# Altium schematic sheet Board.SchDoc
size 584 x 381 mm
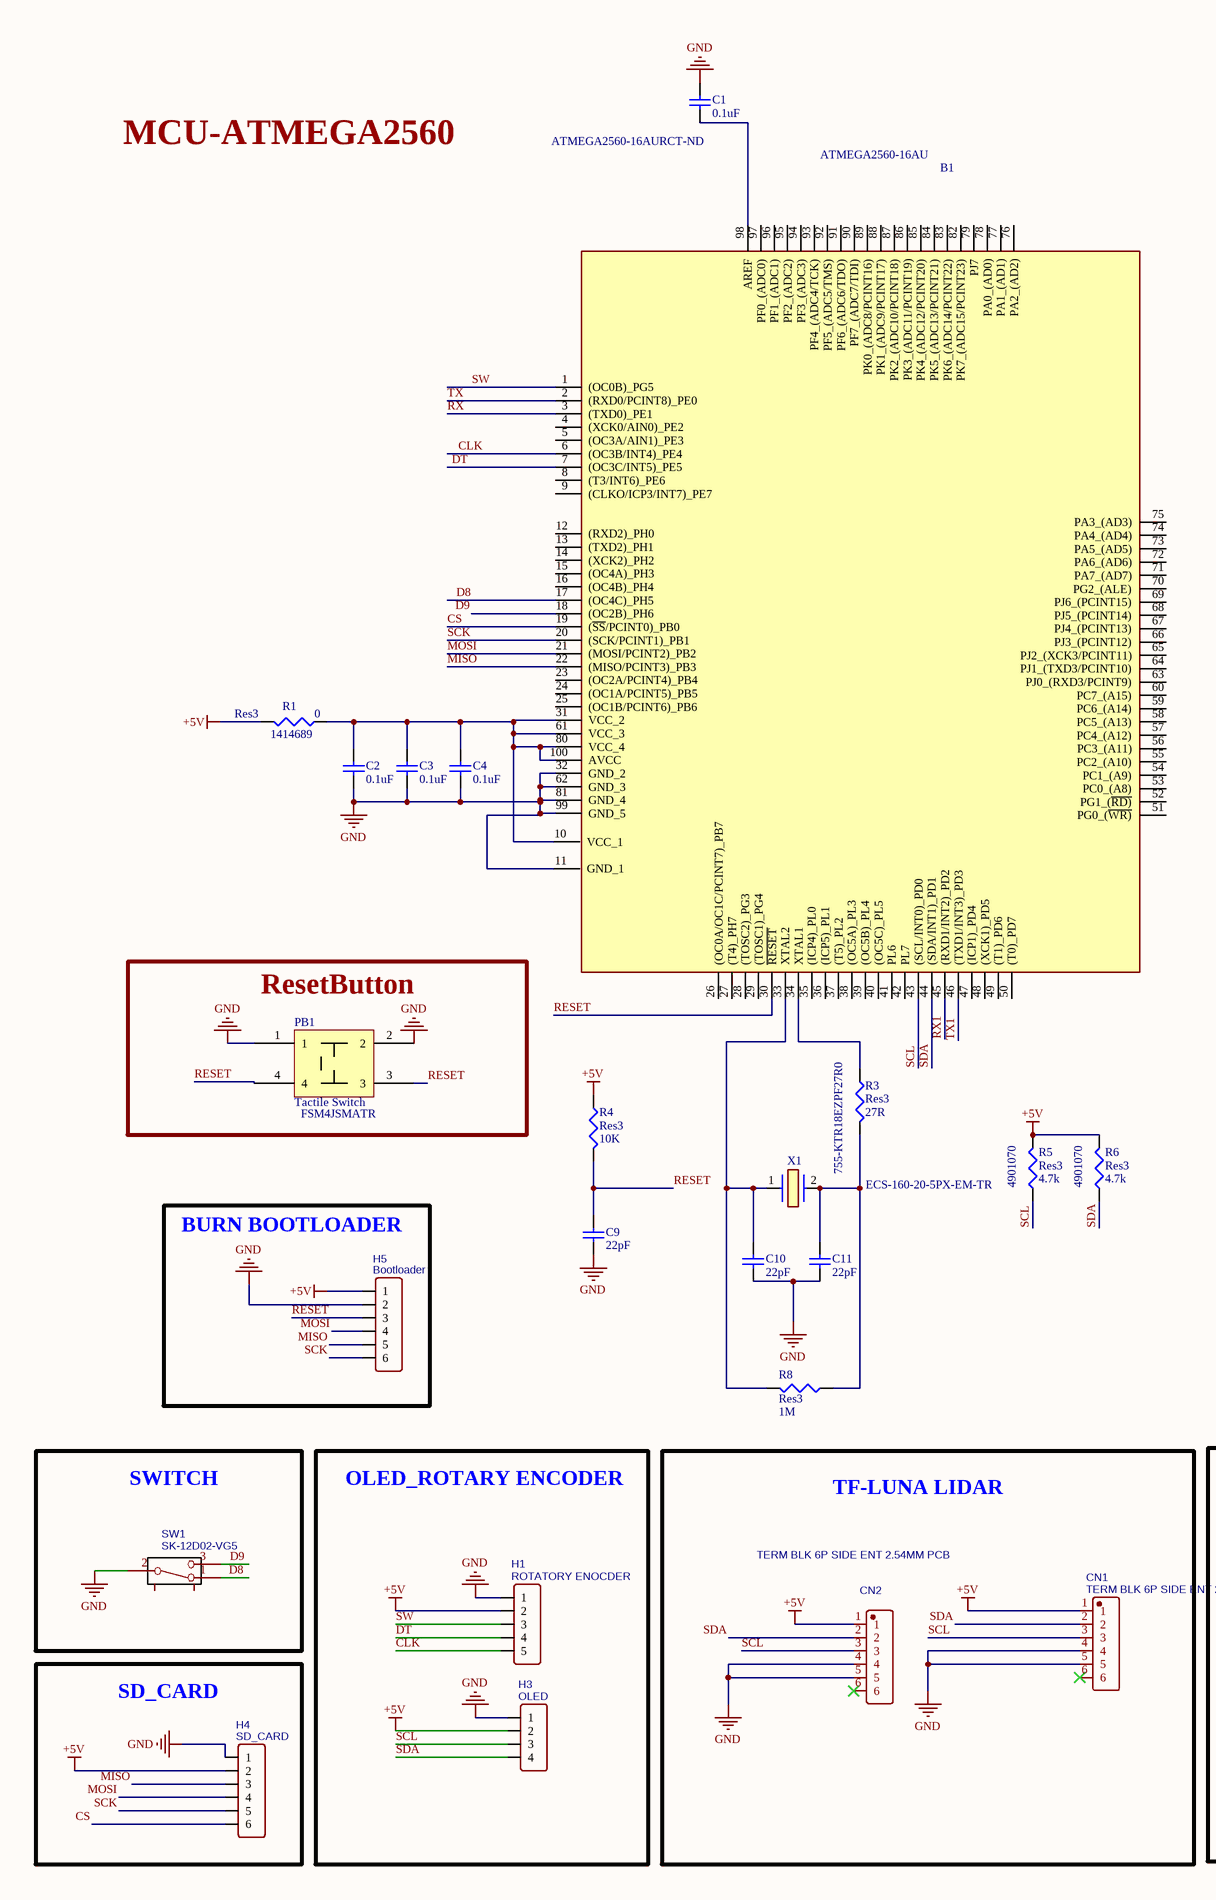
[diagram p0: Board.SchDoc, left]
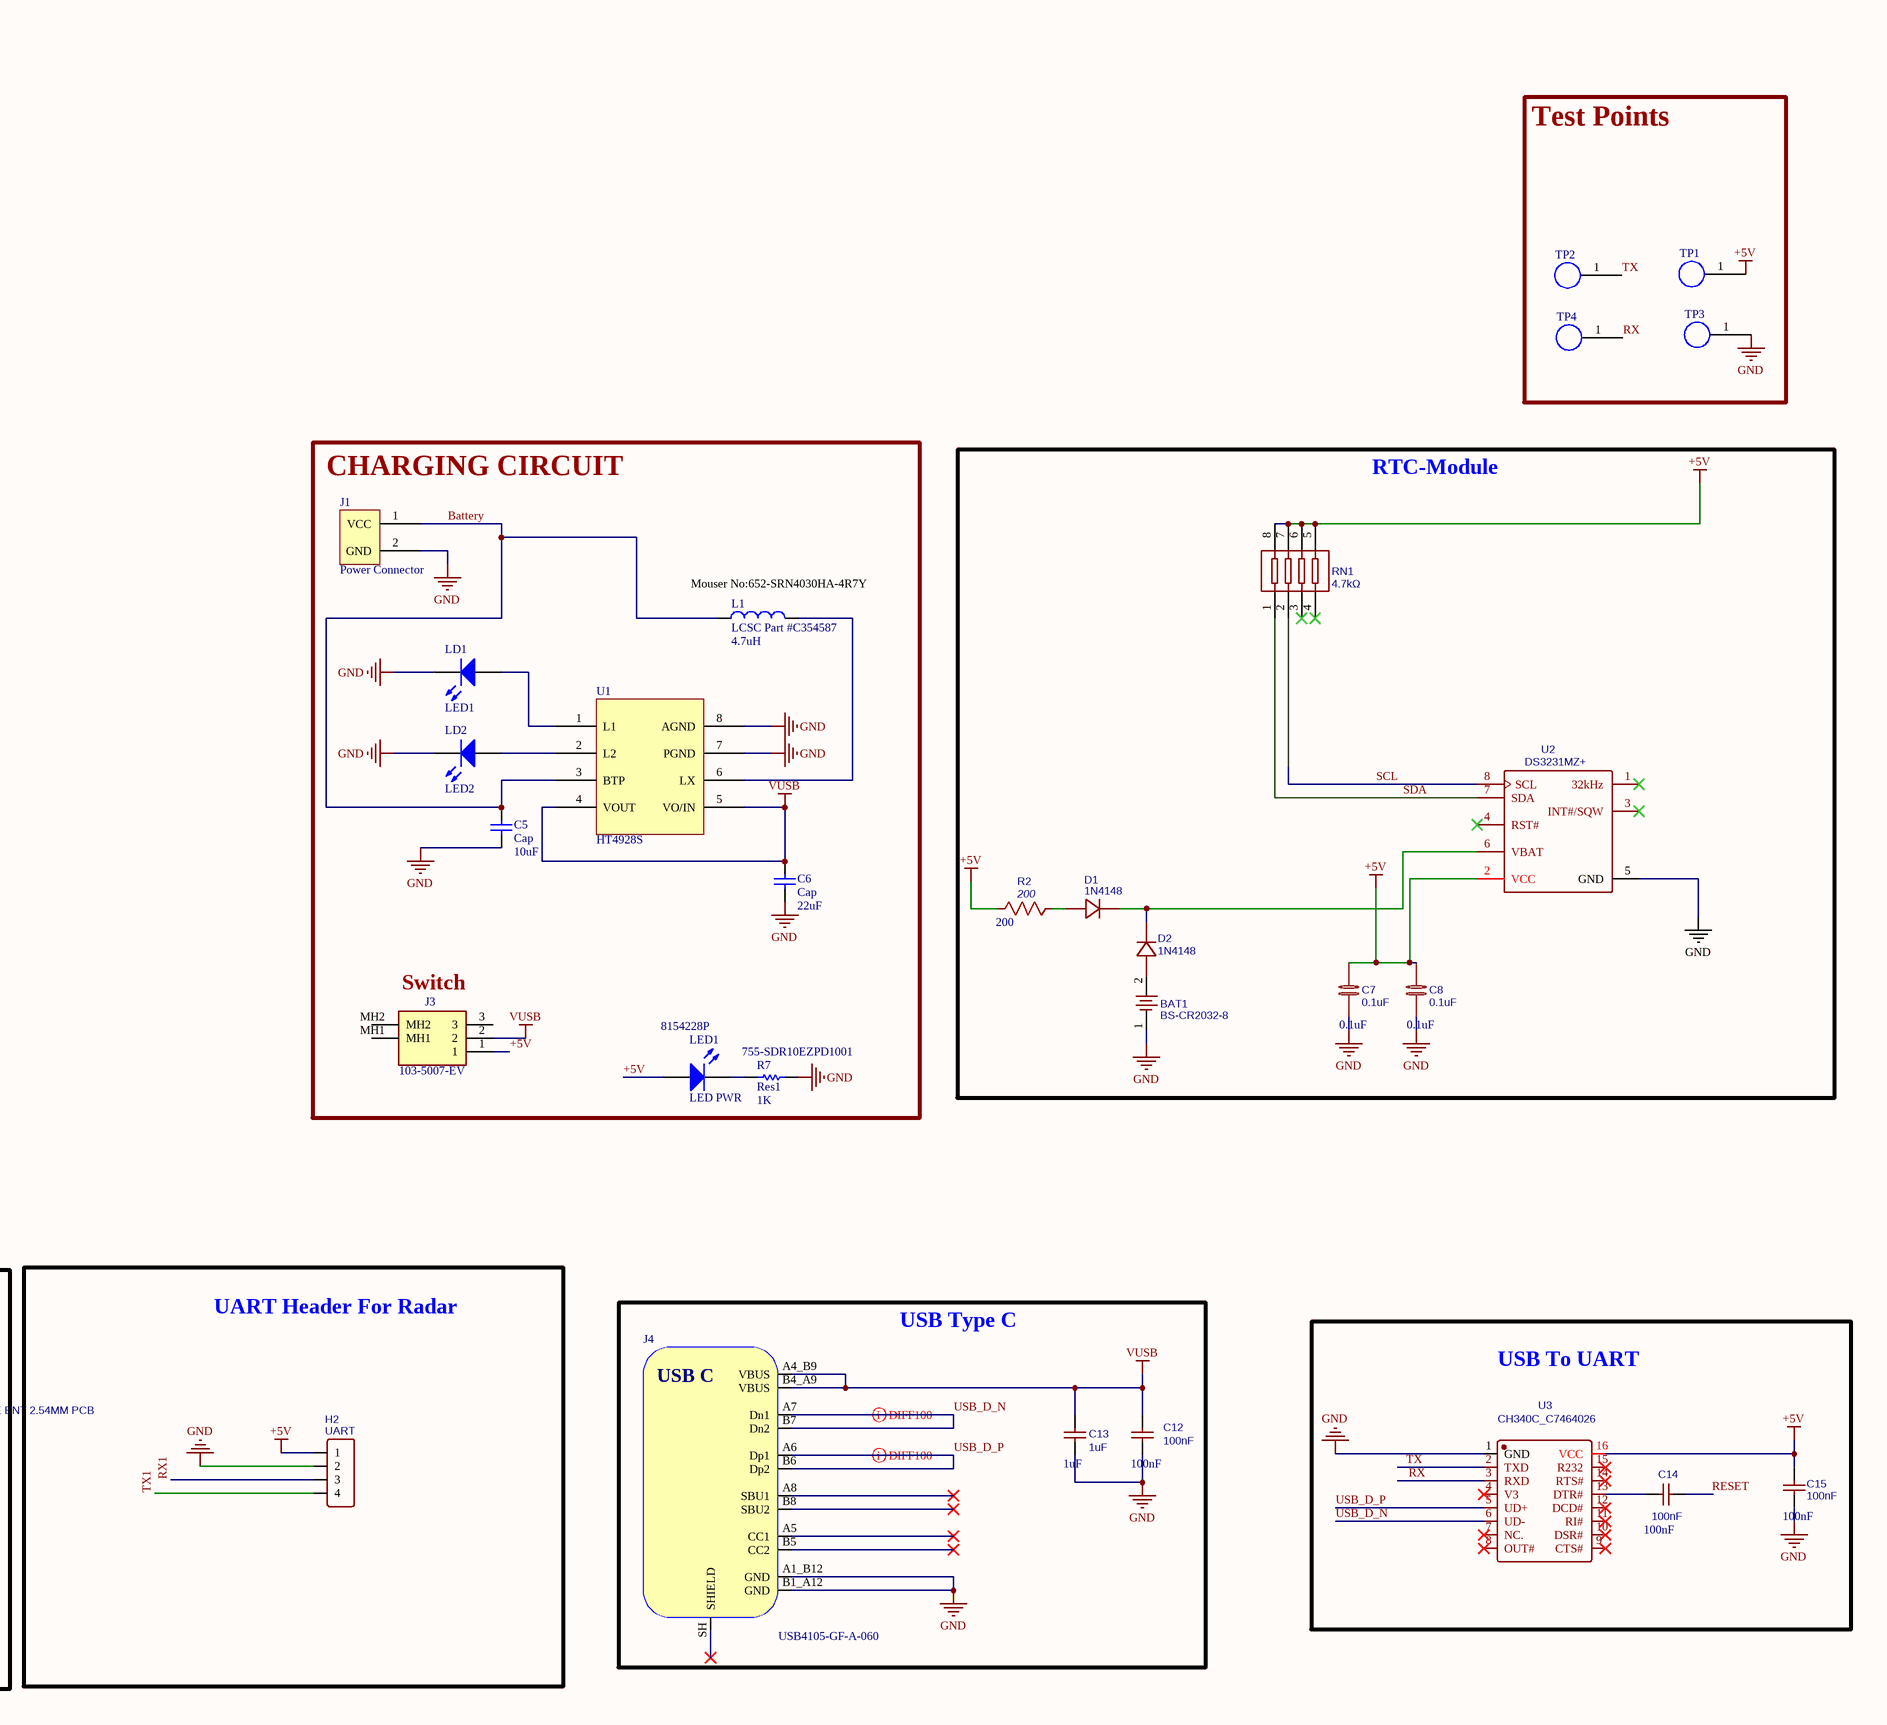
[diagram p1: Board.SchDoc, right]

## Parts
B1  ATMEGA2560-16AU  Supplier Part Number 1: ATMEGA2560-16AURCT-ND  [ATMEGA2560-16AUR]
BAT1  BS-CR2032-8  [BS-CR2032-8]
C1  value 0.1uF  [CAP 0402]  (hidden comment: Cap)
C2  value 0.1uF  [CAP 0402]  (hidden comment: Cap)
C3  value 0.1uF  [CAP 0402]  (hidden comment: Cap)
C4  value 0.1uF  [CAP 0402]  (hidden comment: Cap)
C5  Cap  value 10uF  [Cap_0603]
C6  Cap  value 22uF  [CAP 1206]
C7  0.1uF  [CAP_0805]
C8  0.1uF  [CAP_0805]
C9  value 22pF  [CAP 1206]  (hidden comment: Cap)
C10  value 22pF  [CAP 1206]  (hidden comment: Cap)
C11  value 22pF  [CAP 1206]  (hidden comment: Cap)
C12  100nF  [Cap_0603]
C13  1uF  [Cap_0603]
C14  100nF  [Cap_0603]
C15  100nF  [Cap_0603]
CN1  TERM BLK 6P SIDE ENT 2.54MM PCB  [1725698]
CN2  TERM BLK 6P SIDE ENT 2.54MM PCB  [1725698]
D1  1N4148  [1N4148WS]
D2  1N4148  [1N4148WS]
H1  ROTATORY ENOCDER  [HDR 1X5]
H2  UART  [H2]
H3  OLED  [HDR 1X4]
H4  SD_CARD  [HDR 1X6]
H5  Bootloader  [HDR 1X6]
J1  Power Connector  [1725656]
J3  103-5007-EV  [1035007EV]
J4  USB4105-GF-A-060  [USB4105GFA060]
L1  LCSC Part #C354587  value 4.7uH  [L1]
LD1  LED1  [0603-LED]
LD2  LED2  [0603-LED]
LED1  LED PWR  Supplier Part Number 1: 8154228P  [0603-LED]
PB1  Tactile Switch  Supplier Part Number 1: FSM4JSMATR  [PB1]
R1  Res3  value 0  Supplier Part Number 1: 1414689  [1206-res]
R2  200  [Res_0805]
R3  Res3  value 27R  Supplier Part Number 1: 755-KTR18EZPF27R0  [1206-res]
R4  Res3  value 10K  [1206-res]
R5  Res3  value 4.7k  Supplier Part Number 1: 4901070  [1206-res]
R6  Res3  value 4.7k  Supplier Part Number 1: 4901070  [1206-res]
R7  Res1  value 1K  Supplier Part Number 1: 755-SDR10EZPD1001  [Res_0805]
R8  Res3  value 1M  [1206-res]
RN1  4.7kΩ  [WA04X472JTL]
SW1  SK-12D02-VG5  [SK12D02GA42S]
TP1  (no value)  [TP]
TP2  (no value)  [TP]
TP3  (no value)  [TP]
TP4  (no value)  [TP]
U1  HT4928S  [DS3231MZ+TRL]
U2  DS3231MZ+  [DS3231MZ+TRL]
U3  CH340C_C7464026  [CH340C]
X1  ECS-160-20-5PX-EM-TR  [X1]

## Blocks framed on the sheet
Test Points: TP1-TP4
CHARGING CIRCUIT: C5 C6 J1 J3 L1 LD1 LD2 LED1 R7 U1
RTC-Module: BAT1 C7 C8 D1 D2 R2 RN1 U2
ResetButton: PB1
BURN BOOTLOADER: H5
SWITCH: SW1
OLED_ROTARY ENCODER: H1 H3
TF-LUNA LIDAR: CN1 CN2
UART Header For Radar: H2
USB Type C: C12 C13 J4
USB To UART: C14 C15 U3
SD_CARD: H4

## Nets
+5V: C7.2 C8.2 C15.1 CN1.1 CN2.1 H1.2 H2.1 H3.2 H4.2 H5.1 J3.1 LED1.1(A) R1.2 R2.1 R4.1 R5.2 R6.2 RN1.5 RN1.6 RN1.7 RN1.8 TP1.1(TP) U2.2(VCC) U3.16(VCC)
GND: B1.11(GND_1) B1.32(GND_2) B1.62(GND_3) B1.81(GND_4) B1.99(GND_5) BAT1.1 C1.1 C2.2 C3.2 C4.2 C5.2 C6.2 C7.1 C8.1 C9.2 C10.2 C11.2 C12.1 C13.1 C15.2 CN1.4 CN1.5 CN2.4 CN2.5 H1.1 H2.2 H3.1 H4.1 H5.2 J1.2(GND) J4.A1_B12(GND) J4.B1_A12(GND) LD1.2(K) LD2.2(K) PB1.1 PB1.2 R7.1 SW1.2 TP3.1(TP) U1.7(PGND) U1.8(AGND) U2.5(GND) U3.1(GND)
VUSB: C6.1 C12.2 C13.2 J3.2 J4.A4_B9(VBUS) J4.B4_A9(VBUS) U1.4(VOUT) U1.5(VO/IN)
Battery: C5.1 J1.1(VCC) L1.1 U1.3(BTP)
CLK: B1.6((OC3B/INT4)_PE4) H1.5
CS: B1.19((~{SS}/PCINT0)_PB0) H4.6
D8: B1.17((OC4C)_PH5) SW1.1
D9: B1.18((OC2B)_PH6) SW1.3
DT: B1.7((OC3C/INT5)_PE5) H1.4
MISO: B1.22((MISO/PCINT3)_PB3) H4.3 H5.5
MOSI: B1.21((MOSI/PCINT2)_PB2) H4.4 H5.4
RESET: B1.30(~{RESET}) C9.1 C14.2 H5.3 PB1.3 PB1.4 R4.2
RX: B1.3((TXD0)_PE1) TP4.1(TP) U3.3(RXD)
RX1: B1.45((RXD1/INT2)_PD2) H2.3
SCK: B1.20((SCK/PCINT1)_PB1) H4.5 H5.6
SCL: B1.43((SCL/INT0)_PD0) CN1.3 CN2.3 H3.3 R5.1 RN1.2 U2.8(SCL)
SDA: B1.44((SDA/INT1)_PD1) CN1.2 CN2.2 H3.4 R6.1 RN1.1 U2.7(SDA)
SW: B1.1((OC0B)_PG5) H1.3
TX: B1.2((RXD0/PCINT8)_PE0) TP2.1(TP) U3.2(TXD)
TX1: B1.46((TXD1/INT3)_PD3) H2.4
USB_D_N: J4.A7(Dn1) J4.B7(Dn2) U3.6(UD-)
USB_D_P: J4.A6(Dp1) J4.B6(Dp2) U3.5(UD+)
NetB1_10: B1.10(VCC_1) B1.31(VCC_2) B1.61(VCC_3) B1.80(VCC_4) B1.100(AVCC) C2.1 C3.1 C4.1 R1.1
NetB1_33: B1.33(XTAL2) C10.1 R8.2 X1.1
NetB1_34: B1.34(XTAL1) R3.1
NetB1_98: B1.98(AREF) C1.2
NetBAT1_2: BAT1.2 D2.1(A)
NetC11_1: C11.1 R3.2 R8.1 X1.2(CRYSTAL__2)
NetC14_1: C14.1 U3.13(DTR#)
NetD1_1: D1.1(A) R2.2
NetD1_2: D1.2(C) D2.2(C) U2.6(VBAT)
NetL1_2: L1.2 U1.6(LX)
NetLD1_1: LD1.1(A) U1.1(L1)
NetLD2_1: LD2.1(A) U1.2(L2)
NetLED1_2: LED1.2(K) R7.2

Not connected (* = marked no-connect by the designer): B1 4((XCK0/AIN0)_PE2) 5((OC3A/AIN1)_PE3) 8((T3/INT6)_PE6) 9((CLKO/ICP3/INT7)_PE7) 12((RXD2)_PH0) 13((TXD2)_PH1) 14((XCK2)_PH2) 15((OC4A)_PH3) 16((OC4B)_PH4) 23((OC2A/PCINT4)_PB4) 24((OC1A/PCINT5)_PB5) 25((OC1B/PCINT6)_PB6) 26((OC0A/OC1C/PCINT7)_PB7) 27((T4)_PH7) 28((TOSC2)_PG3) 29((TOSC1)_PG4) 35((ICP4)_PL0) 36((ICP5)_PL1) 37((T5)_PL2) 38((OC5A)_PL3) 39((OC5B)_PL4) 40((OC5C)_PL5) 41(PL6) 42(PL7) 47((ICP1)_PD4) 48((XCK1)_PD5) 49((T1)_PD6) 50((T0)_PD7) 51(PG0_(~{WR)}) 52(PG1_(~{RD)}) 53(PC0_(A8)) 54(PC1_(A9)) 55(PC2_(A10)) 56(PC3_(A11)) 57(PC4_(A12)) 58(PC5_(A13)) 59(PC6_(A14)) 60(PC7_(A15)) 63(PJ0_(RXD3/PCINT9)) 64(PJ1_(TXD3/PCINT10)) 65(PJ2_(XCK3/PCINT11)) 66(PJ3_(PCINT12)) 67(PJ4_(PCINT13)) 68(PJ5_(PCINT14)) 69(PJ6_(PCINT15)) 70(PG2_(ALE)) 71(PA7_(AD7)) 72(PA6_(AD6)) 73(PA5_(AD5)) 74(PA4_(AD4)) 75(PA3_(AD3)) 76(PA2_(AD2)) 77(PA1_(AD1)) 78(PA0_(AD0)) 79(PJ7) 82(PK7_(ADC15/PCINT23)) 83(PK6_(ADC14/PCINT22)) 84(PK5_(ADC13/PCINT21)) 85(PK4_(ADC12/PCINT20)) 86(PK3_(ADC11/PCINT19)) 87(PK2_(ADC10/PCINT18)) 88(PK1_(ADC9/PCINT17)) 89(PK0_(ADC8/PCINT16)) 90(PF7_(ADC7/TDI)) 91(PF6_(ADC6/TDO)) 92(PF5_(ADC5/TMS)) 93(PF4_(ADC4/TCK)) 94(PF3_(ADC3)) 95(PF2_(ADC2)) 96(PF1_(ADC1)) 97(PF0_(ADC0)); CN1 6*; CN2 6*; J3 3 MH1 MH2; J4 A5(CC1)* A8(SBU1)* B5(CC2)* B8(SBU2)* SH(SHIELD)*; RN1 3* 4*; SW1 4 5; U2 1(32kHz)* 3(INT#/SQW)* 4(RST#)*; U3 4(V3)* 7(NC.)* 8(OUT#)* 9(CTS#)* 10(DSR#)* 11(RI#)* 12(DCD#)* 14(RTS#)* 15(R232)*

## Layout directives
differential pair; differential pair class D100: USB_D_N, USB_D_P

## Notes on the sheet
- MCU-ATMEGA2560
- (near L1) Mouser No:652-SRN4030HA-4R7Y
- (near J3) Switch
- (in symbol USB4105-GF-A-060) USB C

## Library data of the parts
B1 = ATMEGA2560-16AU: AVR ATmega Microcontroller 8-bit 16MHz 256KB FLASH TQFP100; Manufacturer_Name: Microchip; Geometry.Height: 1.2mm; Mouser Part Number: 556-ATMEGA2560-16AU; Mouser Price/Stock: https://www.mouser.co.uk/ProductDetail/Microchip-Technology/ATMEGA2560-16AU?qs=aqrrBurbvGciYmlAokFS0w%3D%3D; Manufacturer_Part_Number: ATMEGA2560-16AU; Datasheet Link: https://datasheet.datasheetarchive.com/originals/distributors/Datasheets_SAMA/4a5a397fa76c39b5297f4121ace1d84e.pdf; Supplier 1: Digi-Key; Manufacturer: Microchip; Manufacturer Part Number: ATMEGA2560-16AUR; RoHS: Yes; Category: Microcontrollers; Stock 1: 1214; Pricing 1: 1=15.16 (USD); ComponentLink1URL: http://www.farnell.com/datasheets/1817551.pdf?src-supplier=Farnell; ComponentLink1Description: http://www.farnell.com/datasheets/1817551.pdf?src-supplier=Farnell; ComponentLink2URL: http://www.produktinfo.conrad.com/datenblaetter/1200000-1299999/001267435-da-01-en-IC_MCU_8BI_ATMEGA2560_16AUR_TQFP_100_ATM.pdf?src-supplier=Conrad; ComponentLink2Description: http://www.produktinfo.conrad.com/datenblaetter/1200000-1299999/001267435-da-01-en-IC_MCU_8BI_ATMEGA2560_16AUR_TQFP_100_ATM.pdf?src-supplier=Conrad; ComponentLink3URL: http://www.farnell.com/datasheets/1817551.pdf?src-supplier=Element14; ComponentLink3Description: http://www.farnell.com/datasheets/1817551.pdf?src-supplier=Element14; ComponentLink4URL: http://ww1.microchip.com/downloads/en/DeviceDoc/Atmel-2549-8-bit-AVR-Microcontroller-ATmega640-1280-1281-2560-2561_Summary.pdf?src-supplier=Digi-Key; ComponentLink4Description: http://ww1.microchip.com/downloads/en/DeviceDoc/Atmel-2549-8-bit-AVR-Microcontroller-ATmega640-1280-1281-2560-2561_Summary.pdf?src-supplier=Digi-Key; ComponentLink5URL: http://www.microchip.com/mymicrochip/filehandler.aspx?ddocname=en589901&src-supplier=Digi-Key; ComponentLink5Description: http://www.microchip.com/mymicrochip/filehandler.aspx?ddocname=en589901&src-supplier=Digi-Key; ComponentLink6URL: http://www.farnell.com/datasheets/1817551.pdf?src-supplier=Newark; ComponentLink6Description: http://www.farnell.com/datasheets/1817551.pdf?src-supplier=Newark; ComponentLink7URL: https://datasheet.octopart.com/ATMEGA2560-16AUR-Microchip-datasheet-46907977.pdf?src-supplier=Newark; ComponentLink7Description: https://datasheet.octopart.com/ATMEGA2560-16AUR-Microchip-datasheet-46907977.pdf?src-supplier=Newark
BAT1 = BS-CR2032-8: Manufacturer: LX(连欣科技); Contributor: lcsc; Supplier: LCSC; Supplier Part: C7498149; Manufacturer Part: BS-CR2032-8; JLCPCB Part Class: Extended Part; spicePre: B; spiceSymbolName: BS-CR2032-8
C1-C4 = Cap: Commercial Chip T101 Commercial Tape/reel, 7 Inch Paper Tape; Manufacturer: Kyocera AVX; Manufacturer Part Number: 04023C104KAT2A-62; ComponentLink1URL: https://datasheet.ciiva.com/24216/c3216x5r1v226m160ac-265035-24216573.pdf?src-supplier=Mouser; ComponentLink1Description: https://datasheet.ciiva.com/24216/c3216x5r1v226m160ac-265035-24216573.pdf?src-supplier=Mouser; ComponentLink2URL: https://datasheet.ciiva.com/23803/1796654-23803046.pdf?src-supplier=Newark; ComponentLink2Description: https://datasheet.ciiva.com/23803/1796654-23803046.pdf?src-supplier=Newark; ComponentLink3URL: https://datasheet.ciiva.com/22725/1913358-22725591.pdf?src-supplier=Element14; ComponentLink3Description: https://datasheet.ciiva.com/22725/1913358-22725591.pdf?src-supplier=Element14; ComponentLink4URL: https://datasheet.ciiva.com/22725/1913358-22725592.pdf?src-supplier=Element14; ComponentLink4Description: https://datasheet.ciiva.com/22725/1913358-22725592.pdf?src-supplier=Element14; ComponentLink5URL: https://datasheet.ciiva.com/6259/tdkmlcccaprange-6259231.pdf?src-supplier=Digi-Key; ComponentLink5Description: https://datasheet.ciiva.com/6259/tdkmlcccaprange-6259231.pdf?src-supplier=Digi-Key; Supplier 1: Digi-Key; Supplier Part Number 1: 478-04023C104KAT2A-62CT-ND; RoHS: No; Category: Ceramic Capacitors; Stock 1: 4550; Pricing 1: 1=0.36, 10=0.252, 50=0.1768, 100=0.1515, 500=0.11362, 1000=0.09595, 2500=0.0909, 5000=0.08585 (USD)
C5 C6 = Cap: Capacitor; Published: 8-Jun-2000; LatestRevisionDate: 17-Jul-2002; LatestRevisionNote: Re-released for DXP Platform.; PackageReference: RAD-0.3; Publisher: Altium Limited; PackageDescription: Radial Cap, Thru-Hole; 2 Leads; 0.3 in Pin Spacing
C7 C8 = 0.1uF: Manufacturer Part: CGA4J3X7T2E104KT0Y0N; Manufacturer: TDK; nameAlias: Value(F); Contributor: LCEDA_Lib; Supplier Part: C5119329; Supplier: LCSC; spicePre: C; spiceSymbolName: C_0805_EU; Value: 0.1uF
C9-C11 = Cap: 22.0Pf 50.0V Rohs Compliant: Yes; Manufacturer: KEMET; Manufacturer Part Number: C1206C220K5GAC7210; Dielectric Material: Ceramic; Voltage Rating (DC): 50V; Tolerance: 10%; ComponentLink1URL: https://datasheet.ciiva.com/24216/c3216x5r1v226m160ac-265035-24216573.pdf?src-supplier=Mouser; ComponentLink1Description: https://datasheet.ciiva.com/24216/c3216x5r1v226m160ac-265035-24216573.pdf?src-supplier=Mouser; ComponentLink2URL: https://datasheet.ciiva.com/23803/1796654-23803046.pdf?src-supplier=Newark; ComponentLink2Description: https://datasheet.ciiva.com/23803/1796654-23803046.pdf?src-supplier=Newark; ComponentLink3URL: https://datasheet.ciiva.com/22725/1913358-22725591.pdf?src-supplier=Element14; ComponentLink3Description: https://datasheet.ciiva.com/22725/1913358-22725591.pdf?src-supplier=Element14; ComponentLink4URL: https://datasheet.ciiva.com/22725/1913358-22725592.pdf?src-supplier=Element14; ComponentLink4Description: https://datasheet.ciiva.com/22725/1913358-22725592.pdf?src-supplier=Element14; ComponentLink5URL: https://datasheet.ciiva.com/6259/tdkmlcccaprange-6259231.pdf?src-supplier=Digi-Key; ComponentLink5Description: https://datasheet.ciiva.com/6259/tdkmlcccaprange-6259231.pdf?src-supplier=Digi-Key; Supplier 1: Mouser; Supplier Part Number 1: 80-C1206C220K5GACLR; RoHS: Yes; Category: Ceramic Capacitors; Stock 1: 16832; Pricing 1: 1=0.18, 10=0.129, 50=0.129, 100=0.065, 1000=0.04, 10000=0.03 (USD); Case/Package: 1206; Capacitance: 22pF; Lead Free: Lead Free; RoHS Compliant: Yes
C12 C14 C15 = 100nF: Manufacturer Part: 0603B104K160; Manufacturer: WTC; nameAlias: Capacitance; Supplier: LCSC; Supplier Part: C80516; spicePre: C; spiceSymbolName: 0603B104K160; Value: 100nF
C13 = 1uF: Manufacturer Part: CL10A105KB8NNNC; Manufacturer: SAMSUNG; nameAlias: Capacitance; SMT Type: Basic; Supplier: LCSC; LCSC Assembly: Yes; Supplier Part: C15849; spicePre: C; spiceSymbolName: CL10A105KB8NNNC; Value: 1uF
CN1 CN2 = 6 pin JST: Manufacturer: Phoenix Contact; Contributor: waqasalivicky123; Manufacturer Part: 1725698; spicePre: C; spiceSymbolName: 6 pin JST
D1 D2 = 1N4148_C18195411: Manufacturer: LJ(朗捷); Contributor: lcsc; Supplier: LCSC; Supplier Part: C18195411; Manufacturer Part: 1N4148; JLCPCB Part Class: Extended Part; spicePre: D; spiceSymbolName: 1N4148_C18195411
H1 = ROTATORY ENOCDER: Contributor: LCEDA_Lib; Supplier Part: C50950; Supplier: LCSC; spicePre: H; spiceSymbolName: HDR-F-2.54_1x5
H2 H3 = OLED: Contributor: LCEDA_Lib; spicePre: H
  H2: Supplier Part: 282834-4; Supplier: DIGIKEY; spiceSymbolName: TERM BLK 4P SIDE ENT 2.54MM PCB
  H3: Supplier Part: C225501; Supplier: LCSC; spiceSymbolName: HDR-F-2.54_1x4
H4 H5 = SD_CARD: Contributor: LCEDA_Lib; Supplier Part: C40877; Supplier: LCSC; spicePre: H; spiceSymbolName: HDR-F-2.54_1x6
J1 = Power Connector: TERM BLK 2P SIDE ENT 2.54MM PCB; Manufacturer: Phoenix Contact; Manufacturer Product Number: 1725656
J3 = 103-5007-EV: Switch; Manufacturer_Name: Mountain Switch; Datasheet Link: https://componentsearchengine.com/Datasheets/1/103-5007-EV.pdf; Height: 5.6mm; Manufacturer_Part_Number: 103-5007-EV; Mouser Part Number: 103-5007-EV; Mouser Price/Stock: https://www.mouser.co.uk/ProductDetail/Mountain-Switch/103-5007-EV?qs=AYcD3oPVBmXUe82qMTntdg%3D%3D
J4 = USB4105-GF-A-060: USB Connector Type C SMT 12 Pin; Manufacturer: GCT; Manufacturer Part Number: USB4105-GF-A-060; Distributor Link: https://eu.mouser.com/ProductDetail/GCT/USB4105-GF-A-060?qs=QNEnbhJQKvY2mocwNJzgfA%3D%3D
L1 = Inductor: Code_IEC: 1005; Published: 8-Jun-2000; LatestRevisionDate: 29-May-2009; LatestRevisionNote: IPC-7351 Footprint Added.; PackageReference: 0402-A; Publisher: Altium Limited; PackageDescription: Chip Inductor; Code_JEITA: 0402
LD1 LD2 = LED2: Typical RED, GREEN, YELLOW, AMBER GaAs LED; Published: 8-Jun-2000; LatestRevisionDate: 17-Jul-2002; LatestRevisionNote: Re-released for DXP Platform.; PackageVersion: Feb-2002; PackageReference: 3.2X1.6X1.1; Publisher: Altium Limited; PackageDescription: SM LED; 2 Flat Leads
LED1 = LED0: Led, Blue, 470 Nm, 3.2 V, 30 Ma, 145 Mcd Rohs Compliant: Yes |Wurth Elektronik 150080BS75000; Manufacturer: Wurth Electronics; Lens Color: Colorless; Luminous Intensity: 145mcd; Viewing Angle: 140°; Forward Voltage: 3.2V; Wavelength: 470nm; Lens Style: Clear,Flat,Rectangular; Forward Current: 30mA; Test Current: 20mA; Lens Transparency: Clear; Lens Size: 1.25mm; Published: 8-Jun-2000; LatestRevisionDate: 08-Jul-2005; LatestRevisionNote: Mech Layer 1 removed.; PackageReference: LED-0; Publisher: Altium Limited; PackageDescription: LED; 2 Leads; Supplier 1: Rs; Manufacturer Part Number: 150080BS75000; RoHS: Yes; Category: LEDs; Stock 1: 5350; Pricing 1: 500=0.095, 1000=0.091, 2000=0.086, 4000=0.082 (GBP); Mount: Surface Mount; Case/Package: 0805; Color: Blue; Case Code (Metric): 2012; Case Code (Imperial): 0805; Min Operating Temperature: -40°C; Max Operating Temperature: 85°C; Package Quantity: 1; Packaging: Cut Tape; Dominant Wavelength: 470nm; Series: WL-SMCW; Length: 2mm; Width: 1.25mm; Height: 0.8mm; Lead Free: Lead Free; RoHS Compliant: Yes; Reach SVHC Compliant: Unknown; ComponentLink1URL: https://datasheet.ciiva.com/22656/1740214-22656954.pdf?src-supplier=Element14; ComponentLink1Description: https://datasheet.ciiva.com/22656/1740214-22656954.pdf?src-supplier=Element14; ComponentLink2URL: https://datasheet.ciiva.com/23843/150080bs75000-23843251.pdf?src-supplier=Newark; ComponentLink2Description: https://datasheet.ciiva.com/23843/150080bs75000-23843251.pdf?src-supplier=Newark; ComponentLink3URL: https://datasheet.ciiva.com/29279/759433-da-01-en-chipled-0805-w-kl-blau-150080bs75000-29279203.pdf?src-supplier=Conrad; ComponentLink3Description: https://datasheet.ciiva.com/29279/759433-da-01-en-chipled-0805-w-kl-blau-150080bs75000-29279203.pdf?src-supplier=Conrad; ComponentLink4URL: https://datasheet.ciiva.com/29562/150080bs75000-29562923.pdf?src-supplier=Digi-Key; ComponentLink4Description: https://datasheet.ciiva.com/29562/150080bs75000-29562923.pdf?src-supplier=Digi-Key; ComponentLink5URL: https://datasheet.ciiva.com/29562/150080bs75000-29562922.pdf?src-supplier=Digi-Key; ComponentLink5Description: https://datasheet.ciiva.com/29562/150080bs75000-29562922.pdf?src-supplier=Digi-Key
PB1 = Tactile Switch: Switch Tactile OFF (ON) SPST Round Button Gull Wing 0.05A 24VDC 1.57N SMD T/R; Manufacturer: TE Connectivity Alcoswitch; Actuator Material: Polyphenylene; Mechanical Life: 100000Cycles; Actuator Color: Black; Operating Force: 160gf; Max Current Rating: 50mA; Voltage Rating (DC): 12V; Illumination Type: Non-Illuminated,Illuminated; Connector Type: SMD/SMT; Switch Function: Off-Mom; Actuator Type: Standard; Switch Travel: 0.25mm; Actuator Length: 1.4mm; ComponentLink1URL: https://datasheet.ciiva.com/5283/kmr4-9aug12-31417-5283638.pdf?src-supplier=Mouser; ComponentLink1Description: https://datasheet.ciiva.com/5283/kmr4-9aug12-31417-5283638.pdf?src-supplier=Mouser; ComponentLink2URL: https://datasheet.ciiva.com/7986/1443639-7986968.pdf?src-supplier=Element14; ComponentLink2Description: https://datasheet.ciiva.com/7986/1443639-7986968.pdf?src-supplier=Element14; ComponentLink3URL: https://datasheet.ciiva.com/2901/kmr4-9aug12-2901835.pdf?src-supplier=Digi-Key; ComponentLink3Description: https://datasheet.ciiva.com/2901/kmr4-9aug12-2901835.pdf?src-supplier=Digi-Key; Supplier 1: Arrow Electronics; Manufacturer Part Number: FSM4JSMATR; RoHS: Yes; Category: Pushbutton Switches; Stock 1: 13200; Pricing 1: 1200=0.1814, 2400=0.1646, 6000=0.163, 12000=0.1613 (USD); Mount: Surface Mount; Case/Package: SMD/SMT; Contact Material: Copper Alloy,Copper,Silver; Contact Plating: Silver; Min Operating Temperature: -35°C; Max Operating Temperature: 85°C; Packaging: Tape and Reel; Throw Configuration: SPST; Max Voltage Rating (DC): 12V; Termination: Gull Wing; Orientation: Straight; Contact Current Rating: 50mA; Package Quantity: 1; Current Rating: 50mA; Series: FSMJSMA; Length: 6mm; Depth: 10mm; Radiation Hardening: No; Lead Free: Lead Free; ELV: Compliant; RoHS Compliant: Yes; Reach SVHC Compliant: Unknown; ComponentLink4URL: https://datasheet.ciiva.com/5801/eng-cd-2-1437565-7-u2-5801346.pdf?src-supplier=Farnell; ComponentLink4Description: https://datasheet.ciiva.com/5801/eng-cd-2-1437565-7-u2-5801346.pdf?src-supplier=Farnell; ComponentLink5URL: https://datasheet.ciiva.com/16320/eng-cs-1308111-1-switches-core-program-catalog-0308-16320065.pdf?src-supplier=Future+Electronics; ComponentLink5Description: https://datasheet.ciiva.com/16320/eng-cs-1308111-1-switches-core-program-catalog-0308-16320065.pdf?src-supplier=Future+Electronics; ComponentLink6URL: https://datasheet.ciiva.com/1530/1683375-1530944.pdf?src-supplier=Element14; ComponentLink6Description: https://datasheet.ciiva.com/1530/1683375-1530944.pdf?src-supplier=Element14; ComponentLink7URL: https://datasheet.ciiva.com/23765/1486934-23765878.pdf?src-supplier=Newark; ComponentLink7Description: https://datasheet.ciiva.com/23765/1486934-23765878.pdf?src-supplier=Newark; ComponentLink8URL: https://datasheet.ciiva.com/7638/921681-7638037.pdf?src-supplier=Element14; ComponentLink8Description: https://datasheet.ciiva.com/7638/921681-7638037.pdf?src-supplier=Element14
R1 = Res3: RES SMD 0 OHM JUMPER 1/4W 1206; Manufacturer: Yageo; Manufacturer Part Number: RC1206JR-070RL; Resistance: 0mR; Tolerance: 5%; Power Rating: 250mW; Voltage Rating: 200V; Temperature Coefficient: 200ppm/°C; Published: 8-Jun-2000; LatestRevisionDate: 29-May-2009; LatestRevisionNote: IPC-7351 Footprint Added.; PackageReference: J1-0603; Publisher: Altium Limited; PackageDescription: Chip Resistor; Supplier 1: Future Electronics; RoHS: Yes; Category: Chip SMD Resistors; Stock 1: 14025000; Pricing 1: 5000=0.00420, 25000=0.00400, 100000=0.00370, 250000=0.00360, 625000=0.00340 (USD); Case/Package: 1206; Contact Plating: Tin,Matte; Case Code (Metric): 3216; Case Code (Imperial): 1206; Size Code: 1206; Min Operating Temperature: -55°C; Max Operating Temperature: 155°C; Resistor Type: Thick Film,Carbon Film; Packaging: Tape and Reel; Package Quantity: 1; Number of Terminations: 2; Termination: SMD/SMT; Max Power Dissipation: 250mW; Series: RC; Resistance Tolerance: 5%; Construction: Rectangular; Technology: THICK FILM; Features: Moisture Resistant; Length: 0.122inch; Width: 0.063inch; Height: 0.026inch; Depth: 1.6mm; Radiation Hardening: No; Military Standard: Not; Lead Free: Lead Free; RoHS Compliant: Yes; ComponentLink1URL: https://datasheet.ciiva.com/11808/0900766b80c6630a-11808156.pdf?src-supplier=Rs; ComponentLink1Description: https://datasheet.ciiva.com/11808/0900766b80c6630a-11808156.pdf?src-supplier=Rs; ComponentLink2URL: https://datasheet.ciiva.com/29181/402222-da-01-en-smd-widerstand-0-ohm-1206-29181568.pdf?src-supplier=Conrad; ComponentLink2Description: https://datasheet.ciiva.com/29181/402222-da-01-en-smd-widerstand-0-ohm-1206-29181568.pdf?src-supplier=Conrad; ComponentLink3URL: https://datasheet.ciiva.com/7983/444357-7983807.pdf?src-supplier=Element14; ComponentLink3Description: https://datasheet.ciiva.com/7983/444357-7983807.pdf?src-supplier=Element14; ComponentLink4URL: https://datasheet.ciiva.com/22747/1692832-22747541.pdf?src-supplier=Element14; ComponentLink4Description: https://datasheet.ciiva.com/22747/1692832-22747541.pdf?src-supplier=Element14; ComponentLink5URL: https://datasheet.ciiva.com/46445/444357-46445719.pdf?src-supplier=Element14; ComponentLink5Description: https://datasheet.ciiva.com/46445/444357-46445719.pdf?src-supplier=Element14; ComponentLink6URL: https://datasheet.ciiva.com/2458/pyu-rc1206-51-rohs-l-4-2458669.pdf?src-supplier=Digi-Key; ComponentLink6Description: https://datasheet.ciiva.com/2458/pyu-rc1206-51-rohs-l-4-2458669.pdf?src-supplier=Digi-Key; ComponentLink7URL: https://datasheet.ciiva.com/2458/pyu-rc1206-51-rohs-l-4-2458670.pdf?src-supplier=Digi-Key; ComponentLink7Description: https://datasheet.ciiva.com/2458/pyu-rc1206-51-rohs-l-4-2458670.pdf?src-supplier=Digi-Key; ComponentLink8URL: https://datasheet.ciiva.com/2458/pyu-rc1206-51-rohs-l-4-2458668.pdf?src-supplier=Digi-Key; ComponentLink8Description: https://datasheet.ciiva.com/2458/pyu-rc1206-51-rohs-l-4-2458668.pdf?src-supplier=Digi-Key; ComponentLink9URL: https://datasheet.ciiva.com/7857/1692832-7857422.pdf?src-supplier=Element14; ComponentLink9Description: https://datasheet.ciiva.com/7857/1692832-7857422.pdf?src-supplier=Element14; ComponentLink10URL: https://datasheet.ciiva.com/7857/1692832-7857421.pdf?src-supplier=Element14; ComponentLink10Description: https://datasheet.ciiva.com/7857/1692832-7857421.pdf?src-supplier=Element14; ComponentLink11URL: https://datasheet.ciiva.com/17035/pyu-rc1206-51-rohs-l-4-17035512.pdf?src-supplier=Future+Electronics; ComponentLink11Description: https://datasheet.ciiva.com/17035/pyu-rc1206-51-rohs-l-4-17035512.pdf?src-supplier=Future+Electronics
R2 = 200: Manufacturer Part: PTFR0805Q200RN9; Manufacturer: RESI(开步睿思); nameAlias: Value(Ω); Contributor: LCEDA_Lib; Supplier Part: C23067432; Supplier: LCSC; spicePre: R; spiceSymbolName: R_0805_US; Value: 200
R3 = Res3: Res Thick Film 1206 27 Ohm 1% 0.25W(1/4W) ±100ppm/C Pad SMD Automotive T/R; Manufacturer: Rohm; Manufacturer Part Number: KTR18EZPF27R0; Max Power Dissipation: 250mW; Temperature Coefficient: 100ppm/°C; ComponentLink1URL: https://datasheet.ciiva.com/11808/0900766b80c6630a-11808156.pdf?src-supplier=Rs; ComponentLink1Description: https://datasheet.ciiva.com/11808/0900766b80c6630a-11808156.pdf?src-supplier=Rs; ComponentLink2URL: https://datasheet.ciiva.com/29181/402222-da-01-en-smd-widerstand-0-ohm-1206-29181568.pdf?src-supplier=Conrad; ComponentLink2Description: https://datasheet.ciiva.com/29181/402222-da-01-en-smd-widerstand-0-ohm-1206-29181568.pdf?src-supplier=Conrad; ComponentLink3URL: https://datasheet.ciiva.com/7983/444357-7983807.pdf?src-supplier=Element14; ComponentLink3Description: https://datasheet.ciiva.com/7983/444357-7983807.pdf?src-supplier=Element14; ComponentLink4URL: https://datasheet.ciiva.com/22747/1692832-22747541.pdf?src-supplier=Element14; ComponentLink4Description: https://datasheet.ciiva.com/22747/1692832-22747541.pdf?src-supplier=Element14; ComponentLink5URL: https://datasheet.ciiva.com/46445/444357-46445719.pdf?src-supplier=Element14; ComponentLink5Description: https://datasheet.ciiva.com/46445/444357-46445719.pdf?src-supplier=Element14; ComponentLink6URL: https://datasheet.ciiva.com/2458/pyu-rc1206-51-rohs-l-4-2458669.pdf?src-supplier=Digi-Key; ComponentLink6Description: https://datasheet.ciiva.com/2458/pyu-rc1206-51-rohs-l-4-2458669.pdf?src-supplier=Digi-Key; ComponentLink7URL: https://datasheet.ciiva.com/2458/pyu-rc1206-51-rohs-l-4-2458670.pdf?src-supplier=Digi-Key; ComponentLink7Description: https://datasheet.ciiva.com/2458/pyu-rc1206-51-rohs-l-4-2458670.pdf?src-supplier=Digi-Key; ComponentLink8URL: https://datasheet.ciiva.com/2458/pyu-rc1206-51-rohs-l-4-2458668.pdf?src-supplier=Digi-Key; ComponentLink8Description: https://datasheet.ciiva.com/2458/pyu-rc1206-51-rohs-l-4-2458668.pdf?src-supplier=Digi-Key; ComponentLink9URL: https://datasheet.ciiva.com/7857/1692832-7857422.pdf?src-supplier=Element14; ComponentLink9Description: https://datasheet.ciiva.com/7857/1692832-7857422.pdf?src-supplier=Element14; ComponentLink10URL: https://datasheet.ciiva.com/7857/1692832-7857421.pdf?src-supplier=Element14; ComponentLink10Description: https://datasheet.ciiva.com/7857/1692832-7857421.pdf?src-supplier=Element14; ComponentLink11URL: https://datasheet.ciiva.com/17035/pyu-rc1206-51-rohs-l-4-17035512.pdf?src-supplier=Future+Electronics; ComponentLink11Description: https://datasheet.ciiva.com/17035/pyu-rc1206-51-rohs-l-4-17035512.pdf?src-supplier=Future+Electronics; ComponentLink12URL: https://datasheet.ciiva.com/29181/402621-da-01-en-smd-widerstand-chip1206-4-7-kohm-29181481.pdf?src-supplier=Conrad; ComponentLink12Description: https://datasheet.ciiva.com/29181/402621-da-01-en-smd-widerstand-chip1206-4-7-kohm-29181481.pdf?src-supplier=Conrad; ComponentLink13URL: https://datasheet.ciiva.com/2458/pyu-r-int-thick-7-2458639.pdf?src-supplier=Digi-Key; ComponentLink13Description: https://datasheet.ciiva.com/2458/pyu-r-int-thick-7-2458639.pdf?src-supplier=Digi-Key; ComponentLink14URL: https://datasheet.ciiva.com/2458/pyu-r-int-thick-7-2458640.pdf?src-supplier=Digi-Key; ComponentLink14Description: https://datasheet.ciiva.com/2458/pyu-r-int-thick-7-2458640.pdf?src-supplier=Digi-Key; ComponentLink15URL: https://datasheet.ciiva.com/2458/pyu-r-int-thick-7-2458638.pdf?src-supplier=Digi-Key; ComponentLink15Description: https://datasheet.ciiva.com/2458/pyu-r-int-thick-7-2458638.pdf?src-supplier=Digi-Key; ComponentLink16URL: https://datasheet.ciiva.com/7857/444357-7857512.pdf?src-supplier=Element14; ComponentLink16Description: https://datasheet.ciiva.com/7857/444357-7857512.pdf?src-supplier=Element14; ComponentLink17URL: https://datasheet.ciiva.com/7857/444357-7857511.pdf?src-supplier=Element14; ComponentLink17Description: https://datasheet.ciiva.com/7857/444357-7857511.pdf?src-supplier=Element14; ComponentLink18URL: https://datasheet.ciiva.com/16850/pyu-rc1206-51-rohs-l-4-16850376.pdf?src-supplier=Future+Electronics; ComponentLink18Description: https://datasheet.ciiva.com/16850/pyu-rc1206-51-rohs-l-4-16850376.pdf?src-supplier=Future+Electronics; ComponentLink19URL: http://www.yageo.com.tw/exep/pages/download/literatures/PYu-R_INT-thick_7.pdf?src-supplier=Digi-Key; ComponentLink19Description: http://www.yageo.com.tw/exep/pages/download/literatures/PYu-R_INT-thick_7.pdf?src-supplier=Digi-Key; Supplier 1: Mouser; RoHS: Yes; Category: Chip SMD Resistors; Stock 1: 2737; Pricing 1: 1=0.26, 10=0.134, 50=0.134, 100=0.06, 1000=0.037, 10000=0.026 (USD); Case/Package: 1206; Case Code (Metric): 3216; Case Code (Imperial): 1206; Min Operating Temperature: -55°C; Max Operating Temperature: 155°C; Package Quantity: 1; Packaging: Cut Tape; Resistance: 27R; Tolerance: 1%; Number of Terminations: 2; Features: Automotive AEC-Q200; Series: KTR; Length: 0.126inch; Width: 0.063inch; Height: 0.026inch; RoHS Compliant: Yes; ComponentLink20URL: https://datasheet.ciiva.com/14929/ktr-14929720.pdf?src-supplier=Digi-Key; ComponentLink20Description: https://datasheet.ciiva.com/14929/ktr-14929720.pdf?src-supplier=Digi-Key; ComponentLink21URL: https://datasheet.ciiva.com/14925/ktr-14925148.pdf?src-supplier=Digi-Key; ComponentLink21Description: https://datasheet.ciiva.com/14925/ktr-14925148.pdf?src-supplier=Digi-Key; ComponentLink22URL: https://datasheet.ciiva.com/14927/ktr-14927950.pdf?src-supplier=Digi-Key; ComponentLink22Description: https://datasheet.ciiva.com/14927/ktr-14927950.pdf?src-supplier=Digi-Key
R4 = Res3: Lead Free Chip Resistor Thick Film 1206 10kOhm 5% Paper T/R; Manufacturer: Yageo; Manufacturer Part Number: RC1206JR-0710KP; Resistance: 10kR; Max Power Dissipation: 250mW; Temperature Coefficient: 100ppm/°C; ComponentLink1URL: https://datasheet.ciiva.com/11808/0900766b80c6630a-11808156.pdf?src-supplier=Rs; ComponentLink1Description: https://datasheet.ciiva.com/11808/0900766b80c6630a-11808156.pdf?src-supplier=Rs; ComponentLink2URL: https://datasheet.ciiva.com/29181/402222-da-01-en-smd-widerstand-0-ohm-1206-29181568.pdf?src-supplier=Conrad; ComponentLink2Description: https://datasheet.ciiva.com/29181/402222-da-01-en-smd-widerstand-0-ohm-1206-29181568.pdf?src-supplier=Conrad; ComponentLink3URL: https://datasheet.ciiva.com/7983/444357-7983807.pdf?src-supplier=Element14; ComponentLink3Description: https://datasheet.ciiva.com/7983/444357-7983807.pdf?src-supplier=Element14; ComponentLink4URL: https://datasheet.ciiva.com/22747/1692832-22747541.pdf?src-supplier=Element14; ComponentLink4Description: https://datasheet.ciiva.com/22747/1692832-22747541.pdf?src-supplier=Element14; ComponentLink5URL: https://datasheet.ciiva.com/46445/444357-46445719.pdf?src-supplier=Element14; ComponentLink5Description: https://datasheet.ciiva.com/46445/444357-46445719.pdf?src-supplier=Element14; ComponentLink6URL: https://datasheet.ciiva.com/2458/pyu-rc1206-51-rohs-l-4-2458669.pdf?src-supplier=Digi-Key; ComponentLink6Description: https://datasheet.ciiva.com/2458/pyu-rc1206-51-rohs-l-4-2458669.pdf?src-supplier=Digi-Key; ComponentLink7URL: https://datasheet.ciiva.com/2458/pyu-rc1206-51-rohs-l-4-2458670.pdf?src-supplier=Digi-Key; ComponentLink7Description: https://datasheet.ciiva.com/2458/pyu-rc1206-51-rohs-l-4-2458670.pdf?src-supplier=Digi-Key; ComponentLink8URL: https://datasheet.ciiva.com/2458/pyu-rc1206-51-rohs-l-4-2458668.pdf?src-supplier=Digi-Key; ComponentLink8Description: https://datasheet.ciiva.com/2458/pyu-rc1206-51-rohs-l-4-2458668.pdf?src-supplier=Digi-Key; ComponentLink9URL: https://datasheet.ciiva.com/7857/1692832-7857422.pdf?src-supplier=Element14; ComponentLink9Description: https://datasheet.ciiva.com/7857/1692832-7857422.pdf?src-supplier=Element14; ComponentLink10URL: https://datasheet.ciiva.com/7857/1692832-7857421.pdf?src-supplier=Element14; ComponentLink10Description: https://datasheet.ciiva.com/7857/1692832-7857421.pdf?src-supplier=Element14; ComponentLink11URL: https://datasheet.ciiva.com/17035/pyu-rc1206-51-rohs-l-4-17035512.pdf?src-supplier=Future+Electronics; ComponentLink11Description: https://datasheet.ciiva.com/17035/pyu-rc1206-51-rohs-l-4-17035512.pdf?src-supplier=Future+Electronics; ComponentLink12URL: https://datasheet.ciiva.com/29181/402621-da-01-en-smd-widerstand-chip1206-4-7-kohm-29181481.pdf?src-supplier=Conrad; ComponentLink12Description: https://datasheet.ciiva.com/29181/402621-da-01-en-smd-widerstand-chip1206-4-7-kohm-29181481.pdf?src-supplier=Conrad; ComponentLink13URL: https://datasheet.ciiva.com/2458/pyu-r-int-thick-7-2458639.pdf?src-supplier=Digi-Key; ComponentLink13Description: https://datasheet.ciiva.com/2458/pyu-r-int-thick-7-2458639.pdf?src-supplier=Digi-Key; ComponentLink14URL: https://datasheet.ciiva.com/2458/pyu-r-int-thick-7-2458640.pdf?src-supplier=Digi-Key; ComponentLink14Description: https://datasheet.ciiva.com/2458/pyu-r-int-thick-7-2458640.pdf?src-supplier=Digi-Key; ComponentLink15URL: https://datasheet.ciiva.com/2458/pyu-r-int-thick-7-2458638.pdf?src-supplier=Digi-Key; ComponentLink15Description: https://datasheet.ciiva.com/2458/pyu-r-int-thick-7-2458638.pdf?src-supplier=Digi-Key; ComponentLink16URL: https://datasheet.ciiva.com/7857/444357-7857512.pdf?src-supplier=Element14; ComponentLink16Description: https://datasheet.ciiva.com/7857/444357-7857512.pdf?src-supplier=Element14; ComponentLink17URL: https://datasheet.ciiva.com/7857/444357-7857511.pdf?src-supplier=Element14; ComponentLink17Description: https://datasheet.ciiva.com/7857/444357-7857511.pdf?src-supplier=Element14; ComponentLink18URL: https://datasheet.ciiva.com/16850/pyu-rc1206-51-rohs-l-4-16850376.pdf?src-supplier=Future+Electronics; ComponentLink18Description: https://datasheet.ciiva.com/16850/pyu-rc1206-51-rohs-l-4-16850376.pdf?src-supplier=Future+Electronics; Supplier 1: Digi-Key; Supplier Part Number 1: YAG1339CT-ND; RoHS: Yes; Category: Chip SMD Resistors; Stock 1: 6438; Pricing 1: 1=0.13, 10=0.062, 50=0.0408, 100=0.0346, 500=0.0244, 1000=0.02124 (USD); Case/Package: 1206; Case Code (Metric): 3216; Case Code (Imperial): 1206; Min Operating Temperature: -55°C; Max Operating Temperature: 155°C; Packaging: Cut Tape; Number of Terminations: 2; Tolerance: 5%; Features: Moisture Resistant; Series: RC-P Lead Free; RoHS Compliant: Yes; ComponentLink19URL: http://www.yageo.com.tw/exep/pages/download/literatures/PYu-R_INT-thick_7.pdf?src-supplier=Digi-Key; ComponentLink19Description: http://www.yageo.com.tw/exep/pages/download/literatures/PYu-R_INT-thick_7.pdf?src-supplier=Digi-Key
R5 R6 = Res3: Res Thick Film 1206 4.7K Ohm 5% 1/4W |100ppm/|C SMD Paper T/R; Manufacturer: Yageo; Manufacturer Part Number: RC1206JR-074K7L; Resistance: 4.7kR; Power Rating: 250mW; Voltage Rating: 200V; Temperature Coefficient: 100ppm/°C; ComponentLink1URL: https://datasheet.ciiva.com/11808/0900766b80c6630a-11808156.pdf?src-supplier=Rs; ComponentLink1Description: https://datasheet.ciiva.com/11808/0900766b80c6630a-11808156.pdf?src-supplier=Rs; ComponentLink2URL: https://datasheet.ciiva.com/29181/402222-da-01-en-smd-widerstand-0-ohm-1206-29181568.pdf?src-supplier=Conrad; ComponentLink2Description: https://datasheet.ciiva.com/29181/402222-da-01-en-smd-widerstand-0-ohm-1206-29181568.pdf?src-supplier=Conrad; ComponentLink3URL: https://datasheet.ciiva.com/7983/444357-7983807.pdf?src-supplier=Element14; ComponentLink3Description: https://datasheet.ciiva.com/7983/444357-7983807.pdf?src-supplier=Element14; ComponentLink4URL: https://datasheet.ciiva.com/22747/1692832-22747541.pdf?src-supplier=Element14; ComponentLink4Description: https://datasheet.ciiva.com/22747/1692832-22747541.pdf?src-supplier=Element14; ComponentLink5URL: https://datasheet.ciiva.com/46445/444357-46445719.pdf?src-supplier=Element14; ComponentLink5Description: https://datasheet.ciiva.com/46445/444357-46445719.pdf?src-supplier=Element14; ComponentLink6URL: https://datasheet.ciiva.com/2458/pyu-rc1206-51-rohs-l-4-2458669.pdf?src-supplier=Digi-Key; ComponentLink6Description: https://datasheet.ciiva.com/2458/pyu-rc1206-51-rohs-l-4-2458669.pdf?src-supplier=Digi-Key; ComponentLink7URL: https://datasheet.ciiva.com/2458/pyu-rc1206-51-rohs-l-4-2458670.pdf?src-supplier=Digi-Key; ComponentLink7Description: https://datasheet.ciiva.com/2458/pyu-rc1206-51-rohs-l-4-2458670.pdf?src-supplier=Digi-Key; ComponentLink8URL: https://datasheet.ciiva.com/2458/pyu-rc1206-51-rohs-l-4-2458668.pdf?src-supplier=Digi-Key; ComponentLink8Description: https://datasheet.ciiva.com/2458/pyu-rc1206-51-rohs-l-4-2458668.pdf?src-supplier=Digi-Key; ComponentLink9URL: https://datasheet.ciiva.com/7857/1692832-7857422.pdf?src-supplier=Element14; ComponentLink9Description: https://datasheet.ciiva.com/7857/1692832-7857422.pdf?src-supplier=Element14; ComponentLink10URL: https://datasheet.ciiva.com/7857/1692832-7857421.pdf?src-supplier=Element14; ComponentLink10Description: https://datasheet.ciiva.com/7857/1692832-7857421.pdf?src-supplier=Element14; ComponentLink11URL: https://datasheet.ciiva.com/17035/pyu-rc1206-51-rohs-l-4-17035512.pdf?src-supplier=Future+Electronics; ComponentLink11Description: https://datasheet.ciiva.com/17035/pyu-rc1206-51-rohs-l-4-17035512.pdf?src-supplier=Future+Electronics; Supplier 1: Future Electronics; RoHS: Yes; Category: Chip SMD Resistors; Stock 1: 2945000; Pricing 1: 5000=0.00420, 25000=0.00390, 50000=0.00390, 125000=0.00360, 150000=0.00370, 250000=0.00360, 625000=0.00360, 750000=0.00330, 1500000=0.00330 (USD); Case/Package: 1206; Case Code (Metric): 3216; Case Code (Imperial): 1206; Size Code: 1206; Min Operating Temperature: -55°C; Max Operating Temperature: 155°C; Resistor Type: Thick Film; Tolerance: 5%; Packaging: Tape and Reel; Package Quantity: 1; Number of Terminations: 2; Termination: SMD/SMT; Max Power Dissipation: 250mW; Features: Moisture Resistant; Series: RC; Resistance Tolerance: 5%; Construction: Rectangular; Length: 0.122inch; Width: 0.063inch; Height: 0.026inch; Depth: 1.6mm; Reach SVHC Compliant: Yes; Military Standard: Not; Lead Free: Lead Free; RoHS Compliant: Yes; ComponentLink12URL: https://datasheet.ciiva.com/29181/402621-da-01-en-smd-widerstand-chip1206-4-7-kohm-29181481.pdf?src-supplier=Conrad; ComponentLink12Description: https://datasheet.ciiva.com/29181/402621-da-01-en-smd-widerstand-chip1206-4-7-kohm-29181481.pdf?src-supplier=Conrad; ComponentLink13URL: https://datasheet.ciiva.com/2458/pyu-r-int-thick-7-2458639.pdf?src-supplier=Digi-Key; ComponentLink13Description: https://datasheet.ciiva.com/2458/pyu-r-int-thick-7-2458639.pdf?src-supplier=Digi-Key; ComponentLink14URL: https://datasheet.ciiva.com/2458/pyu-r-int-thick-7-2458640.pdf?src-supplier=Digi-Key; ComponentLink14Description: https://datasheet.ciiva.com/2458/pyu-r-int-thick-7-2458640.pdf?src-supplier=Digi-Key; ComponentLink15URL: https://datasheet.ciiva.com/2458/pyu-r-int-thick-7-2458638.pdf?src-supplier=Digi-Key; ComponentLink15Description: https://datasheet.ciiva.com/2458/pyu-r-int-thick-7-2458638.pdf?src-supplier=Digi-Key; ComponentLink16URL: https://datasheet.ciiva.com/7857/444357-7857512.pdf?src-supplier=Element14; ComponentLink16Description: https://datasheet.ciiva.com/7857/444357-7857512.pdf?src-supplier=Element14; ComponentLink17URL: https://datasheet.ciiva.com/7857/444357-7857511.pdf?src-supplier=Element14; ComponentLink17Description: https://datasheet.ciiva.com/7857/444357-7857511.pdf?src-supplier=Element14; ComponentLink18URL: https://datasheet.ciiva.com/16850/pyu-rc1206-51-rohs-l-4-16850376.pdf?src-supplier=Future+Electronics; ComponentLink18Description: https://datasheet.ciiva.com/16850/pyu-rc1206-51-rohs-l-4-16850376.pdf?src-supplier=Future+Electronics
R7 = Res1: Resistor; Manufacturer: Rohm; Manufacturer Part Number: SDR10EZPD1001; Published: 8-Jun-2000; LatestRevisionDate: 17-Jul-2002; LatestRevisionNote: Re-released for DXP Platform.; PackageReference: AXIAL-0.3; Publisher: Altium Limited; PackageDescription: Axial Device, Thru-Hole; 2 Leads; 0.3 in Pin Spacing; Supplier 1: Mouser; RoHS: No; Stock 1: 8319; Pricing 1: 1=0.26, 10=0.164, 50=0.164, 100=0.074, 1000=0.039, 10000=0.027 (USD)
R8 = Res3: Res Thick Film 1206 1M Ohm 5% 0.25W(1/4W) ±100ppm/C Pad SMD Automotive T/R; Manufacturer: Yageo; Manufacturer Part Number: AC1206JR-071ML; Resistance: 1MR; Power Rating: 250mW; Voltage Rating: 200V; Temperature Coefficient: 100ppm/°C; ComponentLink1URL: https://datasheet.ciiva.com/11808/0900766b80c6630a-11808156.pdf?src-supplier=Rs; ComponentLink1Description: https://datasheet.ciiva.com/11808/0900766b80c6630a-11808156.pdf?src-supplier=Rs; ComponentLink2URL: https://datasheet.ciiva.com/29181/402222-da-01-en-smd-widerstand-0-ohm-1206-29181568.pdf?src-supplier=Conrad; ComponentLink2Description: https://datasheet.ciiva.com/29181/402222-da-01-en-smd-widerstand-0-ohm-1206-29181568.pdf?src-supplier=Conrad; ComponentLink3URL: https://datasheet.ciiva.com/7983/444357-7983807.pdf?src-supplier=Element14; ComponentLink3Description: https://datasheet.ciiva.com/7983/444357-7983807.pdf?src-supplier=Element14; ComponentLink4URL: https://datasheet.ciiva.com/22747/1692832-22747541.pdf?src-supplier=Element14; ComponentLink4Description: https://datasheet.ciiva.com/22747/1692832-22747541.pdf?src-supplier=Element14; ComponentLink5URL: https://datasheet.ciiva.com/46445/444357-46445719.pdf?src-supplier=Element14; ComponentLink5Description: https://datasheet.ciiva.com/46445/444357-46445719.pdf?src-supplier=Element14; ComponentLink6URL: https://datasheet.ciiva.com/2458/pyu-rc1206-51-rohs-l-4-2458669.pdf?src-supplier=Digi-Key; ComponentLink6Description: https://datasheet.ciiva.com/2458/pyu-rc1206-51-rohs-l-4-2458669.pdf?src-supplier=Digi-Key; ComponentLink7URL: https://datasheet.ciiva.com/2458/pyu-rc1206-51-rohs-l-4-2458670.pdf?src-supplier=Digi-Key; ComponentLink7Description: https://datasheet.ciiva.com/2458/pyu-rc1206-51-rohs-l-4-2458670.pdf?src-supplier=Digi-Key; ComponentLink8URL: https://datasheet.ciiva.com/2458/pyu-rc1206-51-rohs-l-4-2458668.pdf?src-supplier=Digi-Key; ComponentLink8Description: https://datasheet.ciiva.com/2458/pyu-rc1206-51-rohs-l-4-2458668.pdf?src-supplier=Digi-Key; ComponentLink9URL: https://datasheet.ciiva.com/7857/1692832-7857422.pdf?src-supplier=Element14; ComponentLink9Description: https://datasheet.ciiva.com/7857/1692832-7857422.pdf?src-supplier=Element14; ComponentLink10URL: https://datasheet.ciiva.com/7857/1692832-7857421.pdf?src-supplier=Element14; ComponentLink10Description: https://datasheet.ciiva.com/7857/1692832-7857421.pdf?src-supplier=Element14; ComponentLink11URL: https://datasheet.ciiva.com/17035/pyu-rc1206-51-rohs-l-4-17035512.pdf?src-supplier=Future+Electronics; ComponentLink11Description: https://datasheet.ciiva.com/17035/pyu-rc1206-51-rohs-l-4-17035512.pdf?src-supplier=Future+Electronics; ComponentLink12URL: https://datasheet.ciiva.com/29181/402621-da-01-en-smd-widerstand-chip1206-4-7-kohm-29181481.pdf?src-supplier=Conrad; ComponentLink12Description: https://datasheet.ciiva.com/29181/402621-da-01-en-smd-widerstand-chip1206-4-7-kohm-29181481.pdf?src-supplier=Conrad; ComponentLink13URL: https://datasheet.ciiva.com/2458/pyu-r-int-thick-7-2458639.pdf?src-supplier=Digi-Key; ComponentLink13Description: https://datasheet.ciiva.com/2458/pyu-r-int-thick-7-2458639.pdf?src-supplier=Digi-Key; ComponentLink14URL: https://datasheet.ciiva.com/2458/pyu-r-int-thick-7-2458640.pdf?src-supplier=Digi-Key; ComponentLink14Description: https://datasheet.ciiva.com/2458/pyu-r-int-thick-7-2458640.pdf?src-supplier=Digi-Key; ComponentLink15URL: https://datasheet.ciiva.com/2458/pyu-r-int-thick-7-2458638.pdf?src-supplier=Digi-Key; ComponentLink15Description: https://datasheet.ciiva.com/2458/pyu-r-int-thick-7-2458638.pdf?src-supplier=Digi-Key; ComponentLink16URL: https://datasheet.ciiva.com/7857/444357-7857512.pdf?src-supplier=Element14; ComponentLink16Description: https://datasheet.ciiva.com/7857/444357-7857512.pdf?src-supplier=Element14; ComponentLink17URL: https://datasheet.ciiva.com/7857/444357-7857511.pdf?src-supplier=Element14; ComponentLink17Description: https://datasheet.ciiva.com/7857/444357-7857511.pdf?src-supplier=Element14; ComponentLink18URL: https://datasheet.ciiva.com/16850/pyu-rc1206-51-rohs-l-4-16850376.pdf?src-supplier=Future+Electronics; ComponentLink18Description: https://datasheet.ciiva.com/16850/pyu-rc1206-51-rohs-l-4-16850376.pdf?src-supplier=Future+Electronics; Supplier 1: Digi-Key; Supplier Part Number 1: YAG3929CT-ND; RoHS: Yes; Category: Chip SMD Resistors; Stock 1: 4854; Pricing 1: 1=0.1, 10=0.041, 50=0.0264, 100=0.0222, 500=0.0155, 1000=0.0135 (USD); Case/Package: 1206; Case Code (Imperial): 1206; Case Code (Metric): 3216; Min Operating Temperature: -55°C; Max Operating Temperature: 155°C; Tolerance: 5%; Packaging: Tape and Reel; Number of Terminations: 2; Termination: SMD/SMT; Max Power Dissipation: 250mW; Features: Moisture Resistant,Automotive AEC-Q200; Series: AC; Length: 0.122inch; Width: 0.063inch; Height: 0.026inch; Ratings: AEC-Q200; RoHS Compliant: Yes; ComponentLink19URL: https://datasheet.ciiva.com/12656/pyu-ac-51-rohs-l-2-12656991.pdf?src-supplier=Mouser; ComponentLink19Description: https://datasheet.ciiva.com/12656/pyu-ac-51-rohs-l-2-12656991.pdf?src-supplier=Mouser
RN1 = 4.7kΩ: Manufacturer: Walsin(华新科); nameAlias: Value; Contributor: LCSC; Supplier: LCSC; Manufacturer Part: WA04X472JTL; Supplier Part: C170191; JLCPCB Part Class: Extended Part; spicePre: R; spiceSymbolName: WA04X472JTL
SW1 = SK-12D02-VG5: Manufacturer: 韩国韩荣; Contributor: LCSC; Supplier: LCSC; Supplier Part: C136722; Manufacturer Part: SK-12D02-VG5; JLCPCB Part Class: Extended Part; spicePre: S; spiceSymbolName: SK-12D02-VG5
TP1-TP4 = Component_1
U2 = DS3231MZ+: Manufacturer: ADI(亚德诺)/MAXIM(美信); Supplier: LCSC; Manufacturer Part: DS3231MZ+TRL; Supplier Part: C107410; JLCPCB Part Class: Extended Part; spicePre: U; spiceSymbolName: DS3231MZ+
U3 = CH340C_C7464026: Manufacturer: WCH(南京沁恒); Contributor: lcsc; Supplier: LCSC; Supplier Part: C7464026; Manufacturer Part: CH340C; JLCPCB Part Class: Extended Part; spicePre: U; spiceSymbolName: CH340C_C7464026
X1 = ABS05-32.768KHZ-6-T: Crystal 16.0000MHZ 20PF SMD; Manufacturer: ECS International; Supplier 1: Digi-Key; Supplier Part Number 1: 50-ECS-160-20-5PX-EM-TRCT-ND; Manufacturer Part Number: ECS-160-20-5PX-EM-TR; RoHS: No; Category: Uncategorized; Stock 1: 1990; Pricing 1: 1=0.45, 10=0.379, 50=0.3408, 100=0.303, 500=0.28784 (USD)